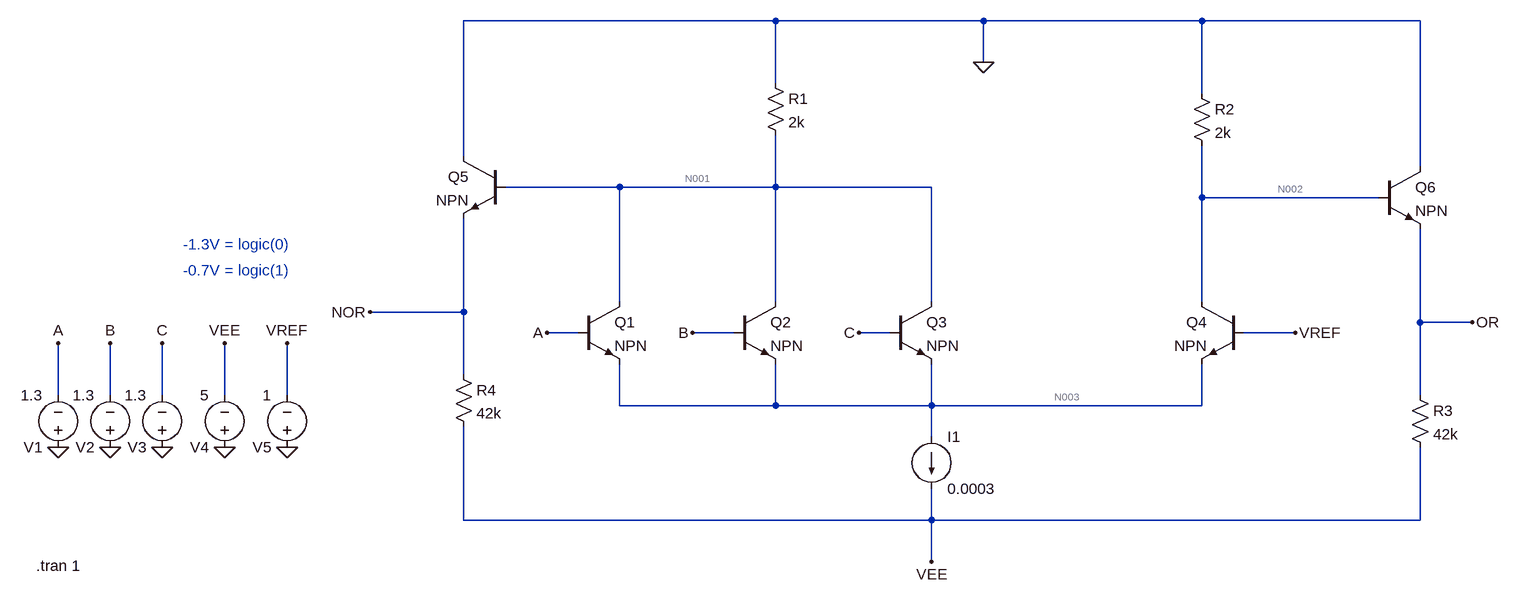
[diagram p0: schematic ecl_nor_or_gate.asc]
ecl_nor_or_gate.asc, the LTspice schematic file:
Version 4
SHEET 1 2292 680
WIRE 1168 -480 688 -480
WIRE 1488 -480 1168 -480
WIRE 1824 -480 1488 -480
WIRE 2160 -480 1824 -480
WIRE 1488 -416 1488 -480
WIRE 1168 -384 1168 -480
WIRE 1824 -368 1824 -480
WIRE 688 -272 688 -480
WIRE 2160 -256 2160 -480
WIRE 928 -224 752 -224
WIRE 1168 -224 1168 -304
WIRE 1168 -224 928 -224
WIRE 1408 -224 1168 -224
WIRE 1824 -208 1824 -288
WIRE 2096 -208 1824 -208
WIRE 928 -48 928 -224
WIRE 1168 -48 1168 -224
WIRE 1408 -48 1408 -224
WIRE 1824 -48 1824 -208
WIRE 688 -32 688 -176
WIRE 688 -32 544 -32
WIRE 2160 -16 2160 -160
WIRE 2240 -16 2160 -16
WIRE 864 0 816 0
WIRE 1104 0 1040 0
WIRE 1344 0 1296 0
WIRE 1968 0 1888 0
WIRE 688 64 688 -32
WIRE 64 96 64 16
WIRE 144 96 144 16
WIRE 224 96 224 16
WIRE 320 96 320 16
WIRE 416 96 416 16
WIRE 2160 96 2160 -16
WIRE 928 112 928 48
WIRE 1168 112 1168 48
WIRE 1168 112 928 112
WIRE 1408 112 1408 48
WIRE 1408 112 1168 112
WIRE 1824 112 1824 48
WIRE 1824 112 1408 112
WIRE 1408 160 1408 112
WIRE 688 288 688 144
WIRE 1408 288 1408 240
WIRE 1408 288 688 288
WIRE 2160 288 2160 176
WIRE 2160 288 1408 288
WIRE 1408 352 1408 288
FLAG 64 176 0
FLAG 144 176 0
FLAG 224 176 0
FLAG 320 176 0
FLAG 416 176 0
FLAG 64 16 A
FLAG 144 16 B
FLAG 224 16 C
FLAG 320 16 VEE
FLAG 416 16 VREF
FLAG 1488 -416 0
FLAG 816 0 A
FLAG 1040 0 B
FLAG 1296 0 C
FLAG 1968 0 VREF
FLAG 2240 -16 OR
FLAG 544 -32 NOR
FLAG 1408 352 VEE
SYMBOL voltage 64 192 R180
WINDOW 123 0 0 Left 0
WINDOW 39 0 0 Left 0
SYMATTR InstName V1
SYMATTR Value 1.3
SYMBOL voltage 144 192 R180
WINDOW 123 0 0 Left 0
WINDOW 39 0 0 Left 0
SYMATTR InstName V2
SYMATTR Value 1.3
SYMBOL voltage 224 192 R180
WINDOW 123 0 0 Left 0
WINDOW 39 0 0 Left 0
SYMATTR InstName V3
SYMATTR Value 1.3
SYMBOL voltage 320 192 R180
WINDOW 123 0 0 Left 0
WINDOW 39 0 0 Left 0
SYMATTR InstName V4
SYMATTR Value 5
SYMBOL voltage 416 192 R180
WINDOW 123 0 0 Left 0
WINDOW 39 0 0 Left 0
SYMATTR InstName V5
SYMATTR Value 1
SYMBOL npn 864 -48 R0
SYMATTR InstName Q1
SYMBOL npn 1104 -48 R0
SYMATTR InstName Q2
SYMBOL npn 1344 -48 R0
SYMATTR InstName Q3
SYMBOL npn 1888 -48 M0
SYMATTR InstName Q4
SYMBOL npn 752 -272 M0
SYMATTR InstName Q5
SYMBOL npn 2096 -256 R0
SYMATTR InstName Q6
SYMBOL res 1152 -400 R0
SYMATTR InstName R1
SYMATTR Value 2k
SYMBOL res 1808 -384 R0
SYMATTR InstName R2
SYMATTR Value 2k
SYMBOL res 2144 80 R0
SYMATTR InstName R3
SYMATTR Value 42k
SYMBOL res 672 48 R0
SYMATTR InstName R4
SYMATTR Value 42k
SYMBOL current 1408 160 R0
WINDOW 123 0 0 Left 0
WINDOW 39 0 0 Left 0
SYMATTR InstName I1
SYMATTR Value 0.0003
TEXT 30 358 Left 2 !.tran 1
TEXT 256 -96 Left 2 ;-0.7V = logic(1)
TEXT 256 -136 Left 2 ;-1.3V = logic(0)

The netlist it stands for:
* ecl_nor_or_gate.asc
V1 0 A 1.3
V2 0 B 1.3
V3 0 C 1.3
V4 0 VEE 5
V5 0 VREF 1
Q1 N001 A N003 0 NPN
Q2 N001 B N003 0 NPN
Q3 N001 C N003 0 NPN
Q4 N002 VREF N003 0 NPN
Q5 0 N001 NOR 0 NPN
Q6 0 N002 OR 0 NPN
R1 0 N001 2k
R2 0 N002 2k
R3 OR VEE 42k
R4 NOR VEE 42k
I1 N003 VEE 0.0003
.model NPN NPN
.model PNP PNP
.lib standard.bjt
.tran 1
* -0.7V = logic(1)
* -1.3V = logic(0)
.backanno
.end

* Results of the author's LTspice run, read from the files saved beside the schematic
* Operating Point, zero values left out:
*   V(a) = -1.3 V
*   V(b) = -1.3 V
*   V(c) = -1.3 V
*   V(vee) = -5 V
*   V(vref) = -1 V
*   V(n001) = -2.036 mV
*   V(n003) = -1.743 V
*   V(n002) = -595.8 mV
*   V(nor) = -717 mV
*   V(or) = -1.307 V
*   Ic(Q6) = 87.06 µA
*   Ib(Q6) = 870.6 nA
*   Ie(Q6) = -87.93 µA
*   Ic(Q5) = 101 µA
*   Ib(Q5) = 1.01 µA
*   Ie(Q5) = -102 µA
*   Ic(Q4) = 297 µA
*   Ib(Q4) = 2.97 µA
*   Ie(Q4) = -300 µA
*   Ic(Q3) = 2.727 nA
*   Ib(Q3) = 26.41 pA
*   Ie(Q3) = -2.754 nA
*   Ic(Q2) = 2.727 nA
*   Ib(Q2) = 26.41 pA
*   Ie(Q2) = -2.754 nA
*   Ic(Q1) = 2.727 nA
*   Ib(Q1) = 26.41 pA
*   Ie(Q1) = -2.754 nA
*   I(I1) = 300 µA
*   I(R4) = 102 µA
*   I(R3) = 87.93 µA
*   I(R2) = 297.9 µA
*   I(R1) = 1.018 µA
*   I(V5) = 2.97 µA
*   I(V4) = -489.9 µA
*   I(V3) = 26.41 pA
*   I(V2) = 26.41 pA
*   I(V1) = 26.41 pA